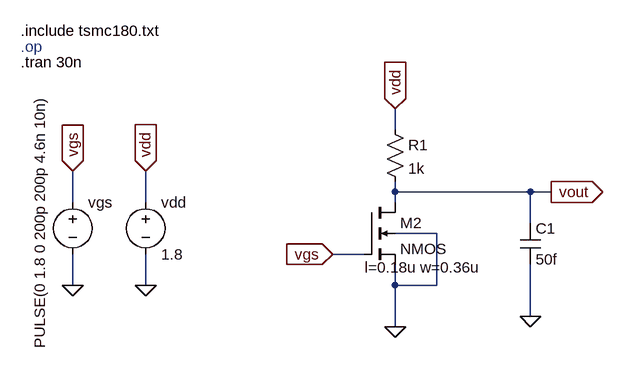
[diagram p0: schematic Strong_0_weak_1_nmos.asc]
Strong_0_weak_1_nmos.asc, the LTspice schematic file:
Version 4
SHEET 1 880 680
WIRE -368 128 -368 96
WIRE -368 224 -368 208
WIRE -160 224 -368 224
WIRE -128 224 -160 224
WIRE -864 240 -864 192
WIRE -752 240 -752 192
WIRE -368 240 -368 224
WIRE -160 272 -160 224
WIRE -304 288 -368 288
WIRE -416 320 -464 320
WIRE -864 368 -864 320
WIRE -752 368 -752 320
WIRE -368 368 -368 336
WIRE -304 368 -304 288
WIRE -304 368 -368 368
WIRE -160 416 -160 336
WIRE -368 432 -368 368
FLAG -368 432 0
FLAG -864 368 0
FLAG -864 192 vgs
IOPIN -864 192 In
FLAG -464 320 vgs
IOPIN -464 320 In
FLAG -752 368 0
FLAG -752 192 vdd
IOPIN -752 192 In
FLAG -368 96 vdd
IOPIN -368 96 In
FLAG -160 416 0
FLAG -128 224 vout
IOPIN -128 224 Out
SYMBOL nmos4 -416 240 R0
WINDOW 123 1 100 Left 2
SYMATTR Value2 l=0.18u w=0.36u
SYMATTR InstName M2
SYMBOL voltage -864 224 R0
WINDOW 123 0 0 Left 0
WINDOW 39 0 0 Left 0
WINDOW 3 -51 -150 VRight 2
SYMATTR Value PULSE(0 1.8 0 200p 200p 4.6n 10n)
SYMATTR InstName vgs
SYMBOL voltage -752 224 R0
WINDOW 123 0 0 Left 0
WINDOW 39 0 0 Left 0
SYMATTR InstName vdd
SYMATTR Value 1.8
SYMBOL res -384 112 R0
SYMATTR InstName R1
SYMATTR Value 1k
SYMBOL cap -176 272 R0
SYMATTR InstName C1
SYMATTR Value 50f
TEXT -944 0 Left 2 ;.op
TEXT -944 -24 Left 2 !.include tsmc180.txt
TEXT -944 24 Left 2 !.tran 30n

The netlist it stands for:
* Strong_0_weak_1_nmos.asc
M2 vout vgs 0 0 NMOS l=0.18u w=0.36u
vgs vgs 0 PULSE(0 1.8 0 200p 200p 4.6n 10n)
vdd vdd 0 1.8
R1 vdd vout 1k
C1 vout 0 50f
.model NMOS NMOS
.model PMOS PMOS
.lib standard.mos
* .op
.include tsmc180.txt
.tran 30n
.backanno
.end